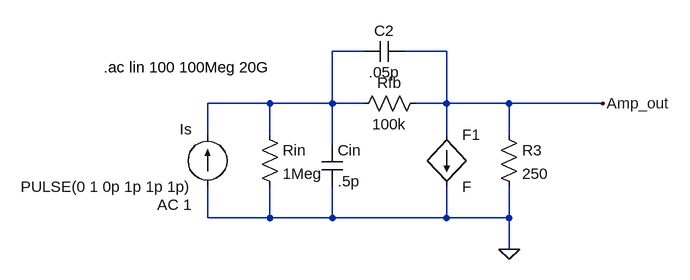
[diagram p0: schematic Draft1.asc]
Draft1.asc, the LTspice schematic file:
Version 4
SHEET 1 880 680
WIRE 0 160 0 112
WIRE 0 112 96 112
WIRE 96 112 96 160
WIRE 0 240 0 288
WIRE 0 288 96 288
WIRE 96 288 96 240
WIRE 96 288 192 288
WIRE 96 112 192 112
WIRE 192 112 192 176
WIRE 192 288 192 240
WIRE 192 288 368 288
WIRE 192 112 192 32
WIRE 192 32 240 32
WIRE 304 32 368 32
WIRE 368 32 368 112
WIRE 368 112 464 112
WIRE 368 240 368 288
WIRE 368 288 464 288
WIRE 192 112 240 112
WIRE 320 112 368 112
WIRE 368 112 368 160
WIRE 464 112 464 160
WIRE 464 240 464 288
WIRE 464 112 608 112
WIRE 464 288 464 336
FLAG 464 336 0
FLAG 608 112 Amp_out
SYMBOL current 0 240 R180
WINDOW 0 24 88 Left 0
WINDOW 3 24 0 Left 0
WINDOW 123 24 -28 Left 0
WINDOW 39 0 0 Left 0
SYMATTR InstName Is
SYMATTR Value PULSE(0 1 0p 1p 1p 1p)
SYMATTR Value2 AC 1
SYMBOL res 80 144 R0
SYMATTR InstName Rin
SYMATTR Value 1Meg
SYMBOL cap 176 176 R0
SYMATTR InstName Cin
SYMATTR Value .5p
SYMBOL cap 240 48 R270
WINDOW 0 32 32 VTop 0
WINDOW 3 0 32 VBottom 0
SYMATTR InstName C2
SYMATTR Value .05p
SYMBOL res 336 96 R90
WINDOW 0 0 56 VBottom 0
WINDOW 3 32 56 VTop 0
SYMATTR InstName Rfb
SYMATTR Value 100k
SYMBOL res 448 144 R0
SYMATTR InstName R3
SYMATTR Value 250
SYMBOL f 368 160 R0
SYMATTR InstName F1
TEXT -160 56 Left 0 !.ac lin 100 100Meg 20G

The netlist it stands for:
* Draft1.asc
Is 0 N001 PULSE(0 1 0p 1p 1p 1p) AC 1
Rin N001 0 1Meg
Cin N001 0 .5p
C2 N001 Amp_out .05p
Rfb Amp_out N001 100k
R3 Amp_out 0 250
F1 Amp_out 0 F
.ac lin 100 100Meg 20G
.backanno
.end